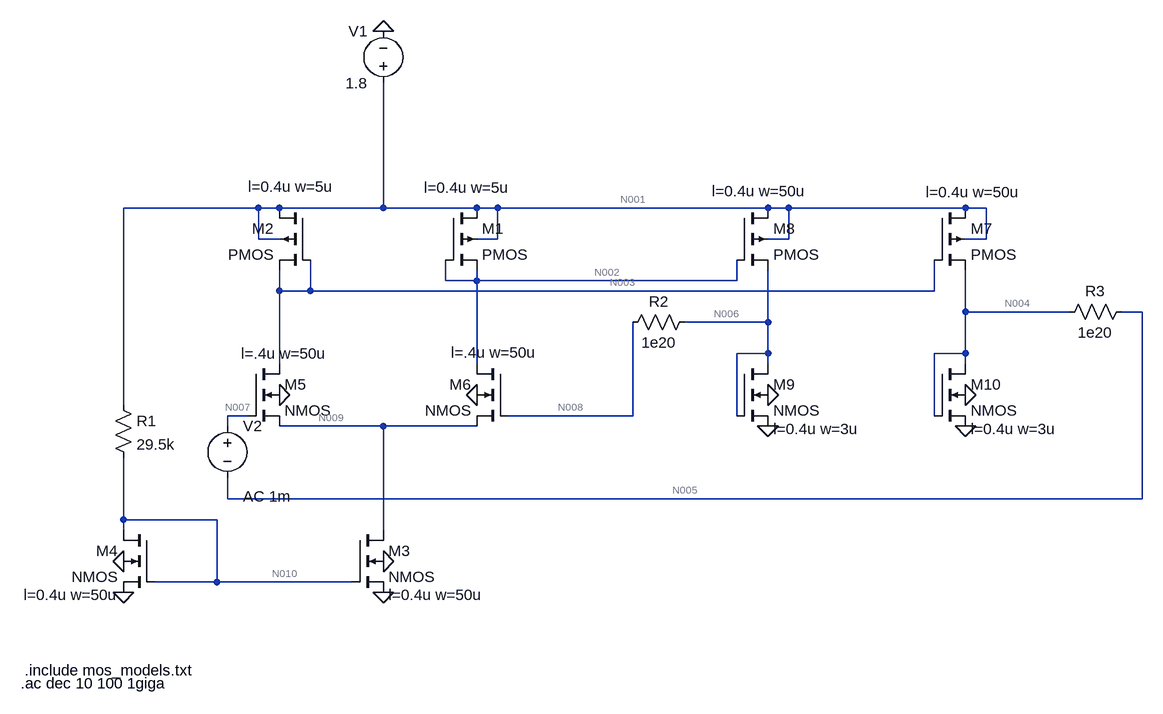
[diagram p0: schematic debug2.asc]
debug2.asc, the LTspice schematic file:
Version 4
SHEET 1 1540 816
WIRE 176 64 -32 64
WIRE 208 64 176 64
WIRE 368 64 368 -128
WIRE 368 64 208 64
WIRE 512 64 368 64
WIRE 544 64 512 64
WIRE 960 64 544 64
WIRE 992 64 960 64
WIRE 1264 64 992 64
WIRE 1296 64 1264 64
WIRE 176 112 176 64
WIRE 208 112 176 112
WIRE 544 112 544 64
WIRE 544 112 512 112
WIRE 992 112 992 64
WIRE 992 112 960 112
WIRE 1296 112 1296 64
WIRE 1296 112 1264 112
WIRE 464 176 464 144
WIRE 512 176 512 160
WIRE 512 176 464 176
WIRE 912 176 912 144
WIRE 912 176 512 176
WIRE 208 192 208 160
WIRE 256 192 256 144
WIRE 256 192 208 192
WIRE 1216 192 1216 144
WIRE 1216 192 256 192
WIRE 1264 224 1264 160
WIRE 1424 224 1264 224
WIRE 1536 224 1504 224
WIRE 960 240 960 160
WIRE 960 240 832 240
WIRE 960 288 960 240
WIRE 960 288 912 288
WIRE 1264 288 1264 224
WIRE 1264 288 1216 288
WIRE 208 304 208 192
WIRE 512 304 512 176
WIRE 960 304 960 288
WIRE 1264 304 1264 288
WIRE -32 368 -32 64
WIRE 160 384 128 384
WIRE 752 384 752 240
WIRE 752 384 560 384
WIRE 912 384 912 288
WIRE 1216 384 1216 288
WIRE 128 400 128 384
WIRE 368 400 208 400
WIRE 512 400 368 400
WIRE 128 512 128 480
WIRE 1536 512 1536 224
WIRE 1536 512 128 512
WIRE -32 544 -32 448
WIRE 112 544 -32 544
WIRE -32 560 -32 544
WIRE 368 560 368 400
WIRE 112 640 112 544
WIRE 112 640 16 640
WIRE 320 640 112 640
FLAG -32 656 0
FLAG 368 656 0
FLAG 368 -208 0
FLAG 368 608 0
FLAG -32 608 0
FLAG 960 400 0
FLAG 960 352 0
FLAG 1264 352 0
FLAG 1264 400 0
FLAG 208 352 0
FLAG 512 352 0
DATAFLAG 960 224 ""
DATAFLAG 208 192 ""
DATAFLAG 112 640 ""
DATAFLAG 144 384 ""
DATAFLAG 368 400 ""
SYMBOL pmos4 464 64 R0
WINDOW 123 -33 -31 Left 2
SYMATTR Value2 l=0.4u w=5u
SYMATTR InstName M1
SYMBOL pmos4 256 64 M0
WINDOW 123 -36 -33 Left 2
SYMATTR Value2 l=0.4u w=5u
SYMATTR InstName M2
SYMBOL voltage 368 -112 R180
WINDOW 0 24 96 Left 2
WINDOW 3 24 16 Left 2
WINDOW 123 0 0 Left 2
WINDOW 39 0 0 Left 2
SYMATTR InstName V1
SYMATTR Value 1.8
SYMBOL nmos4 320 560 R0
WINDOW 123 56 100 Left 2
SYMATTR Value2 l=0.4u w=50u
SYMATTR InstName M3
SYMBOL nmos4 16 560 M0
WINDOW 123 56 100 Left 2
SYMATTR Value2 l=0.4u w=50u
SYMATTR InstName M4
SYMBOL nmos4 160 304 R0
WINDOW 123 -11 -16 Left 2
SYMATTR Value2 l=.4u w=50u
SYMATTR InstName M5
SYMBOL nmos4 560 304 M0
WINDOW 123 -44 -17 Left 2
SYMATTR Value2 l=.4u w=50u
SYMATTR InstName M6
SYMBOL res -48 352 R0
SYMATTR InstName R1
SYMATTR Value 29.5k
SYMBOL pmos4 1216 64 R0
WINDOW 123 -13 -24 Left 2
SYMATTR Value2 l=0.4u w=50u
SYMATTR InstName M7
SYMBOL pmos4 912 64 R0
WINDOW 123 -38 -26 Left 2
SYMATTR Value2 l=0.4u w=50u
SYMATTR InstName M8
SYMBOL nmos4 912 304 R0
WINDOW 123 56 100 Left 2
SYMATTR Value2 l=0.4u w=3u
SYMATTR InstName M9
SYMBOL nmos4 1216 304 R0
WINDOW 123 56 100 Left 2
SYMATTR Value2 l=0.4u w=3u
SYMATTR InstName M10
SYMBOL res 848 224 R90
WINDOW 0 0 56 VBottom 2
WINDOW 3 32 56 VTop 2
SYMATTR InstName R2
SYMATTR Value 1e20
SYMBOL res 1520 208 R90
WINDOW 0 0 56 VBottom 2
WINDOW 3 32 56 VTop 2
SYMATTR InstName R3
SYMATTR Value 1e20
SYMBOL voltage 128 384 R0
WINDOW 123 24 124 Left 2
WINDOW 39 0 0 Left 2
SYMATTR InstName V2
SYMATTR Value ""
SYMATTR Value2 AC 1m
TEXT -184 776 Left 2 !.include mos_models.txt
TEXT -190 796 Left 2 !.ac dec 10 100 1giga

The netlist it stands for:
* debug2.asc
M1 N001 N002 N002 N001 PMOS l=0.4u w=5u
M2 N001 N003 N003 N001 PMOS l=0.4u w=5u
V1 N001 0 1.8
M3 N009 N010 0 0 NMOS l=0.4u w=50u
M4 N010 N010 0 0 NMOS l=0.4u w=50u
M5 N003 N007 N009 0 NMOS l=.4u w=50u
M6 N002 N008 N009 0 NMOS l=.4u w=50u
R1 N001 N010 29.5k
M7 N001 N003 N004 N001 PMOS l=0.4u w=50u
M8 N001 N002 N006 N001 PMOS l=0.4u w=50u
M9 N006 N006 0 0 NMOS l=0.4u w=3u
M10 N004 N004 0 0 NMOS l=0.4u w=3u
R2 N006 N008 1e20
R3 N005 N004 1e20
V2 N007 N005 AC 1m
.model NMOS NMOS
.model PMOS PMOS
.lib standard.mos
.include mos_models.txt
.ac dec 10 100 1giga
.backanno
.end

* Results of the author's LTspice run, read from the files saved beside the schematic
* Operating Point, zero values left out:
*   V(n001) = 1.8 V
*   V(n002) = 1.086 V
*   V(n003) = 1.086 V
*   V(n009) = 434.5 mV
*   V(n010) = 498.9 mV
*   V(n007) = 1.018 V
*   V(n008) = 1.018 V
*   V(n004) = 1.018 V
*   V(n006) = 1.018 V
*   V(n005) = 1.018 V
*   Id(M10) = 220.7 µA
*   Ib(M10) = -1.028 pA
*   Is(M10) = -220.7 µA
*   Id(M9) = 220.7 µA
*   Ib(M9) = -1.028 pA
*   Is(M9) = -220.7 µA
*   Id(M6) = 21.62 µA
*   Ib(M6) = -1.54 pA
*   Is(M6) = -21.62 µA
*   Id(M5) = 21.62 µA
*   Ib(M5) = -1.54 pA
*   Is(M5) = -21.62 µA
*   Id(M4) = 44.1 µA
*   Is(M4) = -44.1 µA
*   Id(M3) = 43.24 µA
*   Is(M3) = -43.24 µA
*   Id(M8) = 220.7 µA
*   Is(M8) = -220.7 µA
*   Id(M7) = 220.7 µA
*   Is(M7) = -220.7 µA
*   Id(M2) = 21.62 µA
*   Is(M2) = -21.62 µA
*   Id(M1) = 21.62 µA
*   Is(M1) = -21.62 µA
*   I(R1) = 44.1 µA
*   I(V1) = -528.7 µA
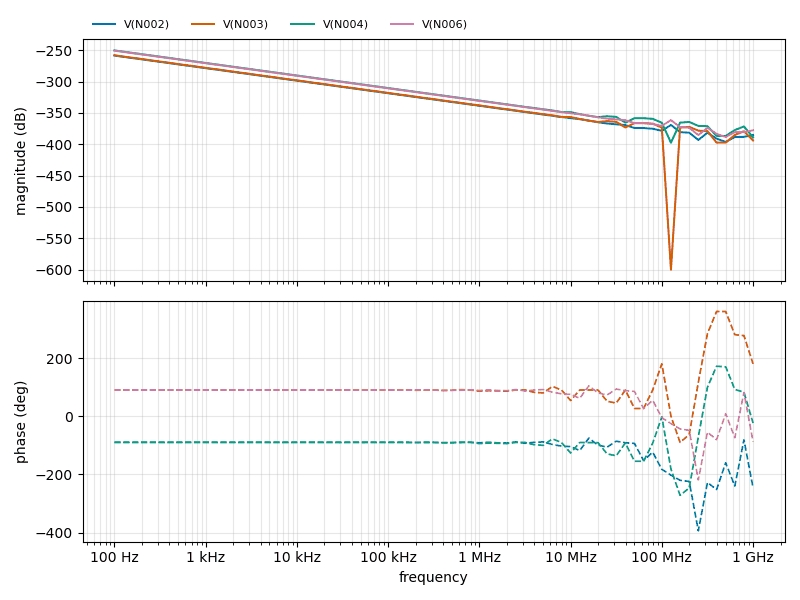
[diagram p1: AC Analysis of debug2.asc, plotted from the saved traces]
* AC Analysis, 1 run:
*   V(N002): -258.67 dB at 100 Hz, -385.26 dB at 1 GHz, peak -258.67 dB at 100 Hz, 3 dB below the peak at 141.4 Hz
*   V(N003): -258.15 dB at 100 Hz, -393.84 dB at 1 GHz, peak -258.15 dB at 100 Hz, 3 dB below the peak at 141.4 Hz
*   V(N004): -250.37 dB at 100 Hz, -389.04 dB at 1 GHz, peak -250.37 dB at 100 Hz, 3 dB below the peak at 141.4 Hz
*   V(N006): -250.89 dB at 100 Hz, -377.80 dB at 1 GHz, peak -250.89 dB at 100 Hz, 3 dB below the peak at 141.4 Hz